# Altium schematic sheet PWM输出.SchDoc: PWM输出
size A4; Author: GAOYANG; Organization: Altium Limited; Address1: L3, 12a Rodborough Rd; Address2: Frenchs Forest; Address3: NSW; Address4: Australia 2086
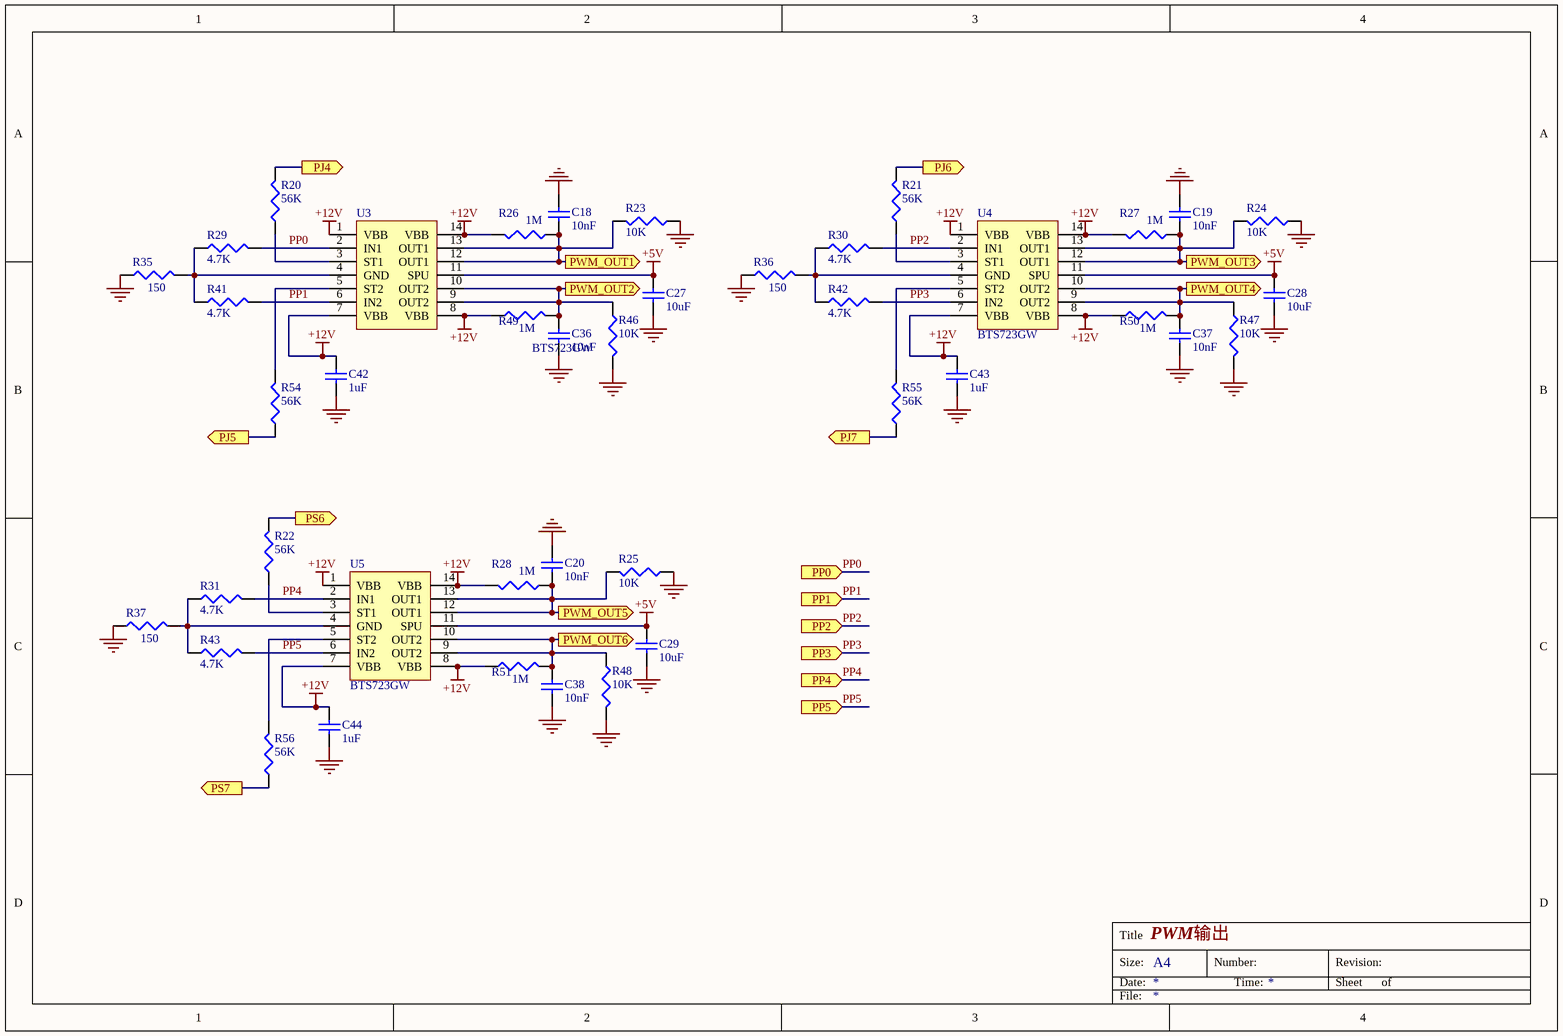
[diagram p0: PWM输出.SchDoc]

## Parts
C18  value 10nF  [0603-L]  (hidden comment: Cap)
C19  value 10nF  [0603-L]  (hidden comment: Cap)
C20  value 10nF  [0603-L]  (hidden comment: Cap)
C27  value 10uF  [0603-L]  (hidden comment: Cap)
C28  value 10uF  [0603-L]  (hidden comment: Cap)
C29  value 10uF  [0603-L]  (hidden comment: Cap)
C36  value 10nF  [0603-L]  (hidden comment: Cap)
C37  value 10nF  [0603-L]  (hidden comment: Cap)
C38  value 10nF  [0603-L]  (hidden comment: Cap)
C42  value 1uF  [0603-L]  (hidden comment: Cap)
C43  value 1uF  [0603-L]  (hidden comment: Cap)
C44  value 1uF  [0603-L]  (hidden comment: Cap)
R20  value 56K  [0603-L]  (hidden comment: Res3)
R21  value 56K  [0603-L]  (hidden comment: Res3)
R22  value 56K  [0603-L]  (hidden comment: Res3)
R23  value 10K  [0603-L]  (hidden comment: Res3)
R24  value 10K  [0603-L]  (hidden comment: Res3)
R25  value 10K  [0603-L]  (hidden comment: Res3)
R26  value 1M  [0603-L]  (hidden comment: Res3)
R27  value 1M  [0603-L]  (hidden comment: Res3)
R28  value 1M  [0603-L]  (hidden comment: Res3)
R29  value 4.7K  [0603-L]  (hidden comment: Res3)
R30  value 4.7K  [0603-L]  (hidden comment: Res3)
R31  value 4.7K  [0603-L]  (hidden comment: Res3)
R35  value 150  [RES1206]  (hidden comment: Res3)
R36  value 150  [RES1206]  (hidden comment: Res3)
R37  value 150  [RES1206]  (hidden comment: Res3)
R41  value 4.7K  [0603-L]  (hidden comment: Res3)
R42  value 4.7K  [0603-L]  (hidden comment: Res3)
R43  value 4.7K  [0603-L]  (hidden comment: Res3)
R46  value 10K  [0603-L]  (hidden comment: Res3)
R47  value 10K  [0603-L]  (hidden comment: Res3)
R48  value 10K  [0603-L]  (hidden comment: Res3)
R49  value 1M  [0603-L]  (hidden comment: Res3)
R50  value 1M  [0603-L]  (hidden comment: Res3)
R51  value 1M  [0603-L]  (hidden comment: Res3)
R54  value 56K  [0603-L]  (hidden comment: Res3)
R55  value 56K  [0603-L]  (hidden comment: Res3)
R56  value 56K  [0603-L]  (hidden comment: Res3)
U3  BTS723GW  [BTS723GW]
U4  BTS723GW  [BTS723GW]
U5  BTS723GW  [BTS723GW]

## Ports
PJ4 (out), PJ5 (out), PJ6 (out), PJ7 (out), PP0 (in), PP1 (in), PP2 (in), PP3 (in), PP4 (in), PP5 (in), PS6 (out), PS7 (out), PWM_OUT1 (out), PWM_OUT2 (out), PWM_OUT3 (out), PWM_OUT4 (out), PWM_OUT5 (out), PWM_OUT6 (out)

## Nets
+5V: C27.1 C28.1 C29.1 U3.11(SPU) U4.11(SPU) U5.11(SPU)
+12V: C42.1 C43.1 C44.1 R26.1 R27.1 R28.1 R49.1 R50.1 R51.1 U3.1(VBB) U3.7(VBB) U3.8(VBB) U3.14(VBB) U4.1(VBB) U4.7(VBB) U4.8(VBB) U4.14(VBB) U5.1(VBB) U5.7(VBB) U5.8(VBB) U5.14(VBB)
GND: C18.2 C19.2 C20.2 C27.2 C28.2 C29.2 C36.2 C37.2 C38.2 C42.2 C43.2 C44.2 R23.2 R24.2 R25.2 R35.1 R36.1 R37.1 R46.1 R47.1 R48.1
PJ4: R20.2 ; port PJ4
PJ5: R54.1 ; port PJ5
PJ6: R21.2 ; port PJ6
PJ7: R55.1 ; port PJ7
PP0: R29.2 U3.2(IN1) ; port PP0
PP1: R41.2 U3.6(IN2) ; port PP1
PP2: R30.2 U4.2(IN1) ; port PP2
PP3: R42.2 U4.6(IN2) ; port PP3
PP4: R31.2 U5.2(IN1) ; port PP4
PP5: R43.2 U5.6(IN2) ; port PP5
PS6: R22.2 ; port PS6
PS7: R56.1 ; port PS7
PWM_OUT1: C18.1 R23.1 R26.2 U3.12(OUT1) U3.13(OUT1) ; port PWM_OUT1
PWM_OUT2: C36.1 R46.2 R49.2 U3.9(OUT2) U3.10(OUT2) ; port PWM_OUT2
PWM_OUT3: C19.1 R24.1 R27.2 U4.12(OUT1) U4.13(OUT1) ; port PWM_OUT3
PWM_OUT4: C37.1 R47.2 R50.2 U4.9(OUT2) U4.10(OUT2) ; port PWM_OUT4
PWM_OUT5: C20.1 R25.1 R28.2 U5.12(OUT1) U5.13(OUT1) ; port PWM_OUT5
PWM_OUT6: C38.1 R48.2 R51.2 U5.9(OUT2) U5.10(OUT2) ; port PWM_OUT6
NetR20_1: R20.1 U3.3(ST1)
NetR21_1: R21.1 U4.3(ST1)
NetR22_1: R22.1 U5.3(ST1)
NetR29_1: R29.1 R35.2 R41.1 U3.4(GND)
NetR30_1: R30.1 R36.2 R42.1 U4.4(GND)
NetR31_1: R31.1 R37.2 R43.1 U5.4(GND)
NetR54_2: R54.2 U3.5(ST2)
NetR55_2: R55.2 U4.5(ST2)
NetR56_2: R56.2 U5.5(ST2)

## Notes on the sheet
- Title
- Size:
- Date:
- A4
- Number:
- Time:
- Revision:
- Sheet
- of
- File:

## Library data of the parts
C18-C20 C27-C29 C36-C38 C42-C44 = Cap: Capacitor; Published: 8-Jun-2000; LatestRevisionDate: 17-Jul-2002; LatestRevisionNote: Re-released for DXP Platform.; PackageReference: RAD-0.3; Publisher: Altium Limited; PackageDescription: Radial Cap, Thru-Hole; 2 Leads; 0.3 in Pin Spacing
R20-R31 R35-R37 R41-R43 R46-R51 R54-R56 = Res3: Resistor; Published: 8-Jun-2000; LatestRevisionDate: 29-May-2009; LatestRevisionNote: IPC-7351 Footprint Added.; PackageReference: J1-0603; Publisher: Altium Limited; PackageDescription: Chip Resistor